# EAGLE design NQSMHS-V2_final (EAGLE 5.11)

## Sheet 1 of 4
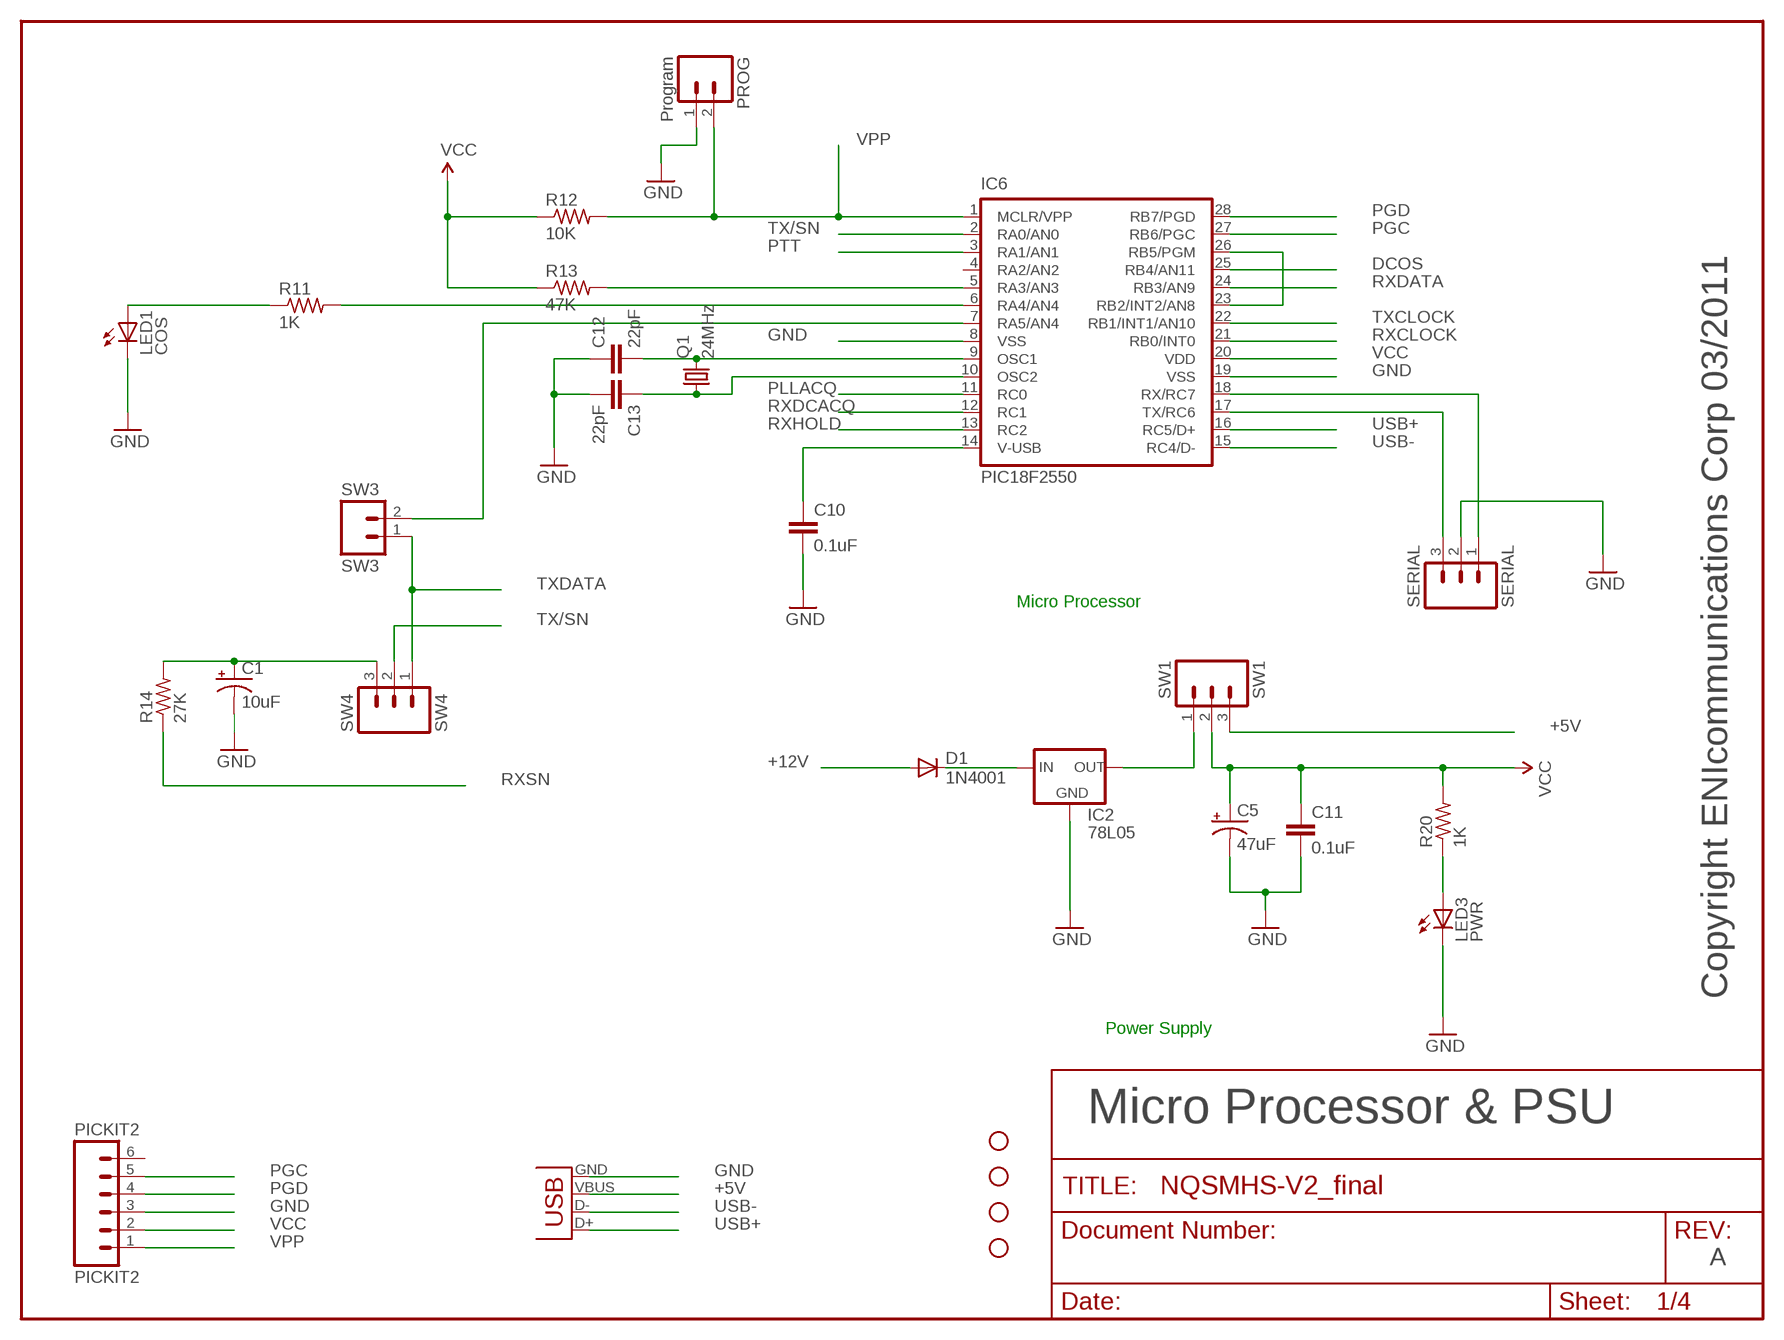
[diagram p0: schematic, sheet 1]

### Parts
C1  10uF  CAP_POLPTH2  [CPOL-RADIAL-10UF-25V]
C5  47uF  CAP_POLPTH2  [CPOL-RADIAL-10UF-25V]
C10  0.1uF  C2.5/2  [C2.5-2]
C11  0.1uF  C2.5/2  [C2.5-2]
C12  22pF  C2.5/2  [C2.5-2]
C13  22pF  C2.5/2  [C2.5-2]
D1  1N4001  DIODEPTH  [DIODE-1N4001]
IC2  78L05  78LXX  [78LXX]
IC6  PIC18F2550  [DIL28-3]
J1  USBPTH  [USB-B-PTH]
JP7  STAND-OFF  [STAND-OFF]
JP8  STAND-OFF  [STAND-OFF]
JP9  STAND-OFF  [STAND-OFF]
JP10  STAND-OFF  [STAND-OFF]
LED1  COS  LED5MM  [LED5MM]
LED3  PWR  LED5MM  [LED5MM]
PICKIT2  PICKIT2  M06SIP  [1X06]
PROG  Program  M02PTH  [1X02]
Q1  24MHz  CRYSTALHC49US  [HC49US]
R11  1K  R-US_0207/2V  [0207/2V]
R12  10K  R-US_0207/2V  [0207/2V]
R13  47K  R-US_0207/2V  [0207/2V]
R14  27K  R-US_0207/2V  [0207/2V]
R20  1K  R-US_0207/2V  [0207/2V]
SERIAL  SERIAL  M03PTH  [1X03]
SW1  SW1  M03PTH  [1X03]
SW3  SW3  M02PTH  [1X02]
SW4  SW4  M03PTH  [1X03]

### Nets
+5V: J1.VBUS SW1.3
+12V: D1.A ; also sheet 2
DCOS: IC6.25(RB4/AN11) ; also sheet 3
GND: C1.2(-) C5.2(-) C10.2 C11.2 C12.1 C13.2 IC2.GND IC6.8(VSS) IC6.19(VSS) J1.GND LED1.K(C) LED3.K(C) PICKIT2.3 PROG.1 SERIAL.2 ; also sheet 2,3,4
N$2: D1.C IC2.IN
N$3: IC6.23(RB2/INT2/AN8) IC6.26(RB5/PGM)
N$4: IC6.5(RA3/AN3) R13.2
N$5: IC6.6(RA4/AN4) R11.2
N$6: LED1.A R11.1
N$7: IC6.7(RA5/AN4) SW3.2
N$8: C1.1(+) R14.2 SW4.3
N$9: C12.2 IC6.9(OSC1) Q1.2
N$10: C13.1 IC6.10(OSC2) Q1.1
N$11: C10.1 IC6.14(V-USB)
N$12: IC2.OUT SW1.1
N$13: LED3.A R20.1
PGC: IC6.27(RB6/PGC) PICKIT2.5
PGD: IC6.28(RB7/PGD) PICKIT2.4
PLLACQ: IC6.11(RC0) ; also sheet 4
PTT: IC6.3(RA1/AN1) ; also sheet 2
RX-232: IC6.18(RX/RC7) SERIAL.1
RXCLOCK: IC6.21(RB0/INT0) ; also sheet 4
RXDATA: IC6.24(RB3/AN9) ; also sheet 4
RXDCACQ: IC6.12(RC1) ; also sheet 4
RXHOLD: IC6.13(RC2) ; also sheet 4
RXSN: R14.1 ; also sheet 3,4
TX-232: IC6.17(TX/RC6) SERIAL.3
TX/SN: IC6.2(RA0/AN0) SW4.2
TXCLOCK: IC6.22(RB1/INT1/AN10) ; also sheet 4
TXDATA: SW3.1 SW4.1 ; also sheet 4
USB+: IC6.16(RC5/D+) J1.D+
USB-: IC6.15(RC4/D-) J1.D-
VCC: C5.1(+) C11.1 IC6.20(VDD) PICKIT2.2 R12.1 R13.1 R20.2 SW1.2 ; also sheet 2,3,4
VPP: IC6.1(MCLR/VPP) PICKIT2.1 PROG.2 R12.2
Unconnected: IC6.4(RA2/AN2) PICKIT2.6

### Notes on the sheet
- Micro Processor
- Copyright ENIcommunications Corp 03/2011
- Power Supply
- Micro Processor & PSU
- A

## Sheet 2 of 4
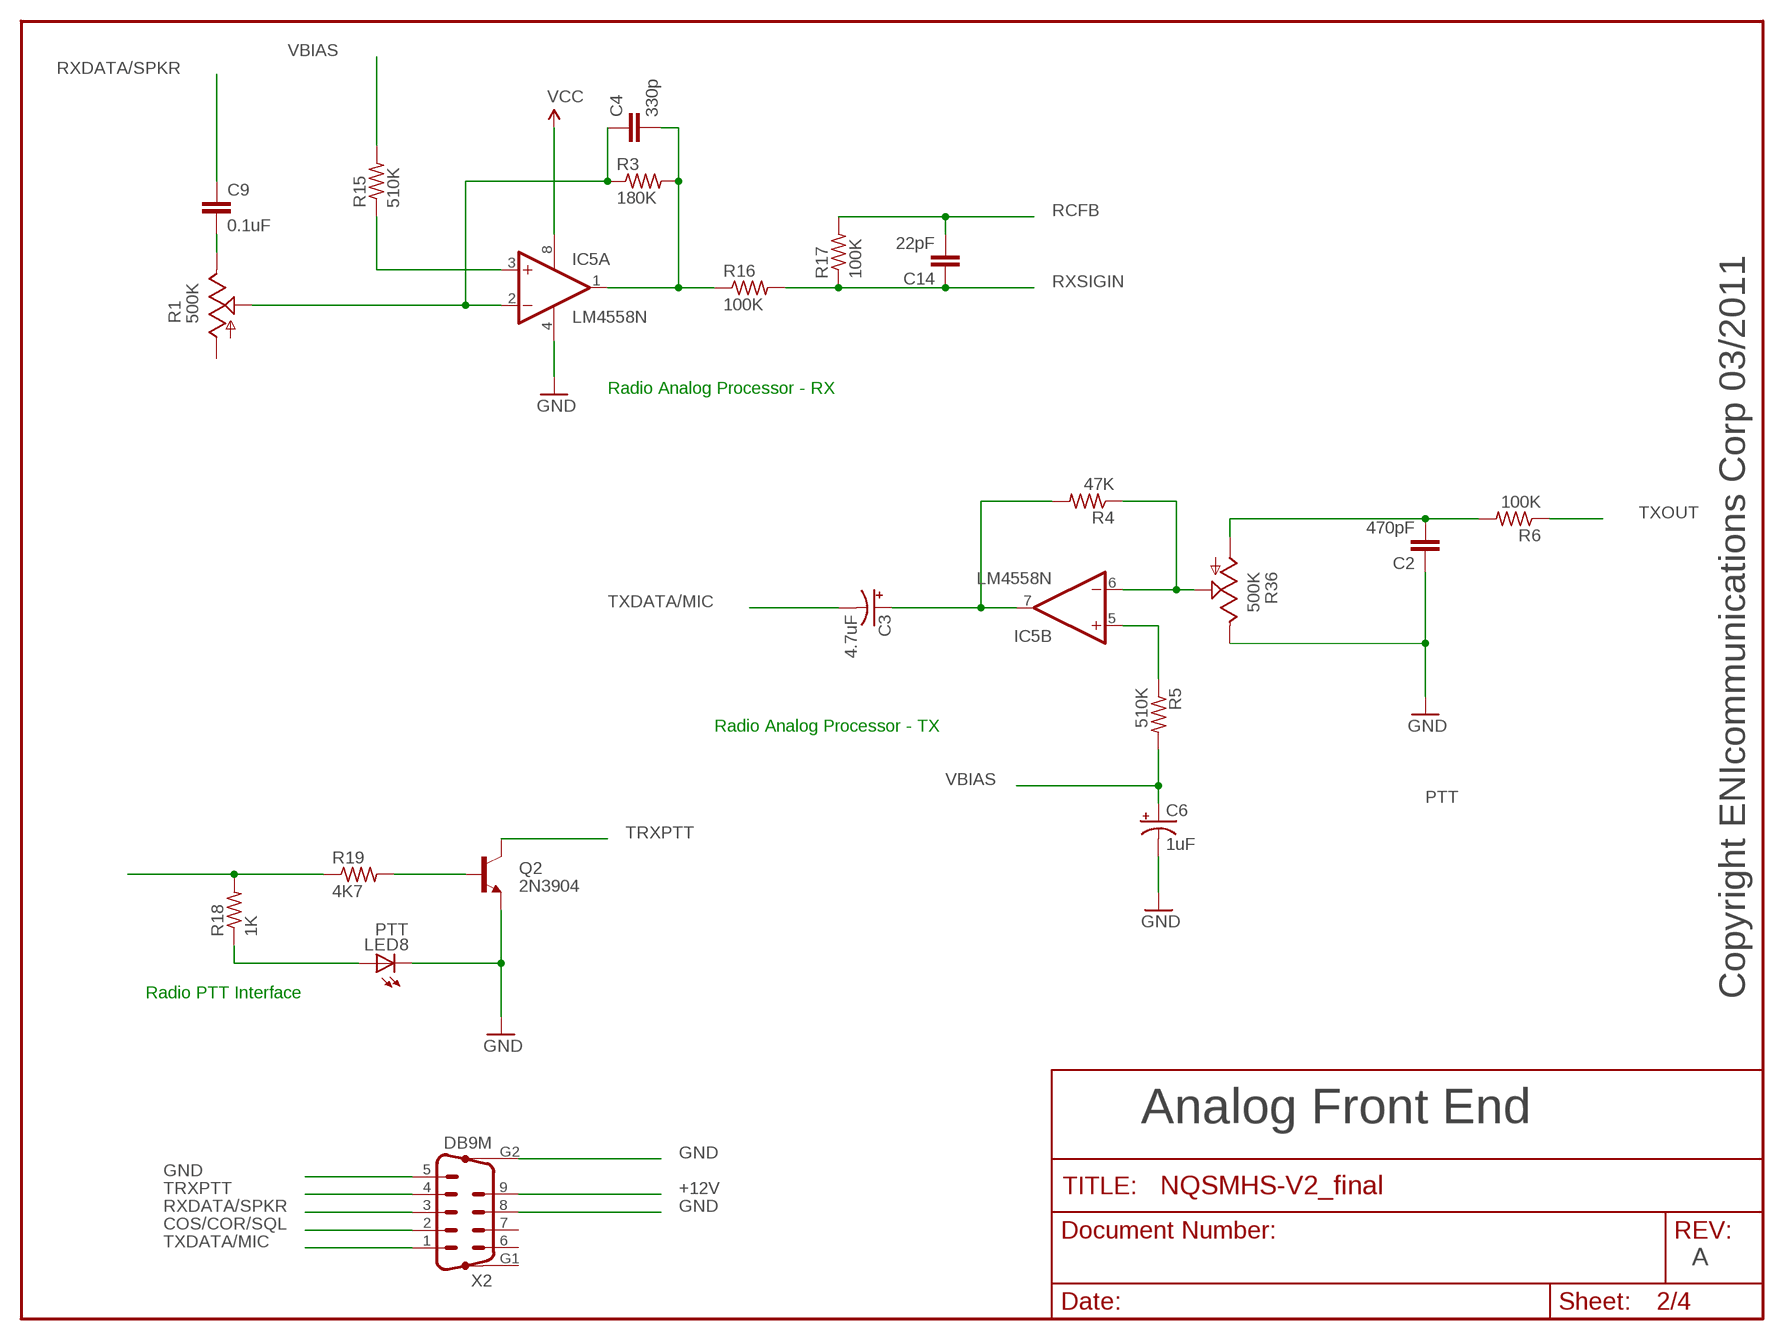
[diagram p1: schematic, sheet 2]

### Parts
C2  470pF  C2.5/2  [C2.5-2]
C3  4.7uF  CAP_POLPTH2  [CPOL-RADIAL-10UF-25V]
C4  330p  C2.5/2  [C2.5-2]
C6  1uF  CAP_POLPTH2  [CPOL-RADIAL-10UF-25V]
C9  0.1uF  C2.5/2  [C2.5-2]
C14  22pF  C2.5/2  [C2.5-2]
IC5  LM4558N  [DIL08]
LED8  PTT  LED5MM  [LED5MM]
Q2  2N3904  TRANSISTOR_NPNTO92  [TO-92]
R1  500K  TRIM_US-CA6V  [CA6V]
R3  180K  R-US_0207/2V  [0207/2V]
R4  47K  R-US_0207/2V  [0207/2V]
R5  510K  R-US_0207/2V  [0207/2V]
R6  100K  R-US_0207/2V  [0207/2V]
R15  510K  R-US_0207/2V  [0207/2V]
R16  100K  R-US_0207/2V  [0207/2V]
R17  100K  R-US_0207/2V  [0207/2V]
R18  1K  R-US_0207/2V  [0207/2V]
R19  4K7  R-US_0207/2V  [0207/2V]
R36  500K  TRIM_US-CA6V  [CA6V]
X2  DB9M  M09HP  [M09HP]

### Nets
+12V: X2.9 ; also sheet 1
COS/COR/SQL: X2.2
GND: C2.1 C6.2(-) IC5.4(P:V-) LED8.K(C) Q2.1(E) R36.E X2.5 X2.8 X2.G2 ; also sheet 1,3,4
N$15: Q2.2(B) R19.2
N$17: LED8.A R18.1
N$19: C3.1(+) IC5.7(B:OUT) R4.2
N$23: C4.2 IC5.1(A:OUT) R3.2 R16.1
N$25: IC5.5(B:+IN) R5.1
N$26: C4.1 IC5.2(A:-IN) R1.S R3.1
N$27: C2.2 R6.2 R36.A
N$28: IC5.6(B:-IN) R4.1 R36.S
N$37: C9.2 R1.E
N$40: IC5.3(A:+IN) R15.1
PTT: R18.2 R19.1 ; also sheet 1
RCFB: C14.2 R17.2 ; also sheet 4
RXDATA/SPKR: C9.1 X2.3
RXSIGIN: C14.1 R16.2 R17.1 ; also sheet 4
TRXPTT: Q2.3(C) X2.4
TXDATA/MIC: C3.2(-) X2.1
TXOUT: R6.1 ; also sheet 4
VBIAS: C6.1(+) R5.2 R15.2 ; also sheet 4
VCC: IC5.8(P:V+) ; also sheet 1,3,4
Unconnected: R1.A X2.6 X2.7 X2.G1

### Notes on the sheet
- Radio Analog Processor - RX
- Radio Analog Processor - TX
- Radio PTT Interface | Copyright ENIcommunications Corp 03/2011
- Analog Front End
- A

## Sheet 3 of 4
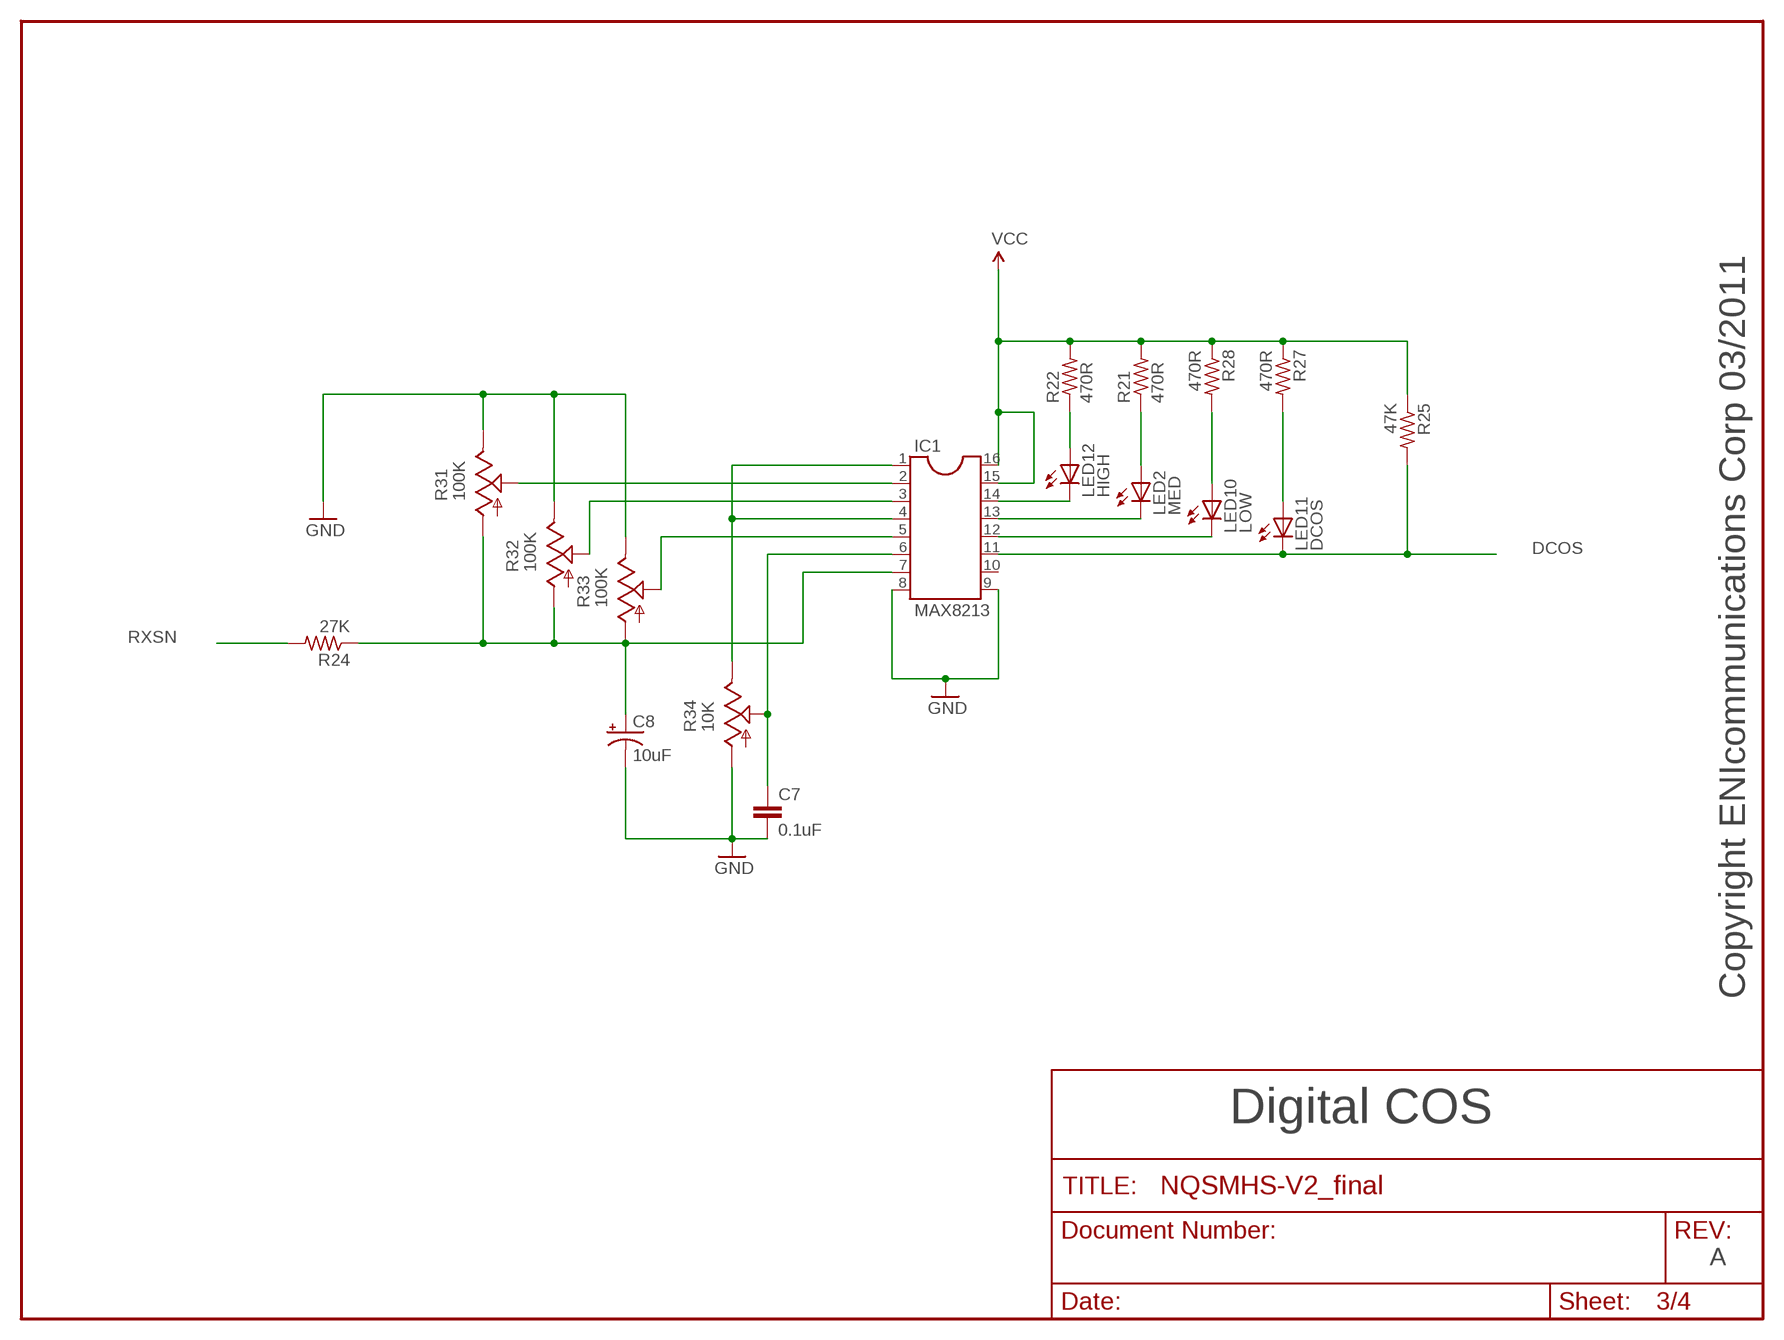
[diagram p2: schematic, sheet 3]

### Parts
C7  0.1uF  C2.5/2  [C2.5-2]
C8  10uF  CAP_POLPTH2  [CPOL-RADIAL-10UF-25V]
IC1  MAX8213  DIL16  [DIL16]
LED2  MED  LED5MM  [LED5MM]
LED10  LOW  LED5MM  [LED5MM]
LED11  DCOS  LED5MM  [LED5MM]
LED12  HIGH  LED5MM  [LED5MM]
R21  470R  R-US_0207/2V  [0207/2V]
R22  470R  R-US_0207/2V  [0207/2V]
R24  27K  R-US_0207/2V  [0207/2V]
R25  47K  R-US_0207/2V  [0207/2V]
R27  470R  R-US_0207/2V  [0207/2V]
R28  470R  R-US_0207/2V  [0207/2V]
R31  100K  TRIM_US-CA6V  [CA6V]
R32  100K  TRIM_US-CA6V  [CA6V]
R33  100K  TRIM_US-CA6V  [CA6V]
R34  10K  TRIM_US-CA6V  [CA6V]

### Nets
DCOS: IC1.11 LED11.K(C) R25.2 ; also sheet 1
GND: C7.2 C8.2(-) IC1.8 IC1.9 R31.E R32.E R33.E R34.A ; also sheet 1,2,4
N$14: C7.1 IC1.6 R34.S
N$16: IC1.14 LED12.K(C)
N$41: LED12.A R22.1
N$44: IC1.13 LED2.K(C)
N$45: LED2.A R21.1
N$46: IC1.12 LED10.K(C)
N$47: LED11.A R27.2
N$48: LED10.A R28.2
N$49: IC1.2 R31.S
N$50: IC1.3 R32.S
N$51: IC1.5 R33.S
N$52: IC1.1 IC1.4 R34.E
N$53: C8.1(+) IC1.7 R24.1 R31.A R32.A R33.A
RXSN: R24.2 ; also sheet 1,4
VCC: IC1.15 IC1.16 R21.2 R22.2 R25.1 R27.1 R28.1 ; also sheet 1,2,4
Unconnected: IC1.10

### Notes on the sheet
- Copyright ENIcommunications Corp 03/2011
- Digital COS
- A

## Sheet 4 of 4
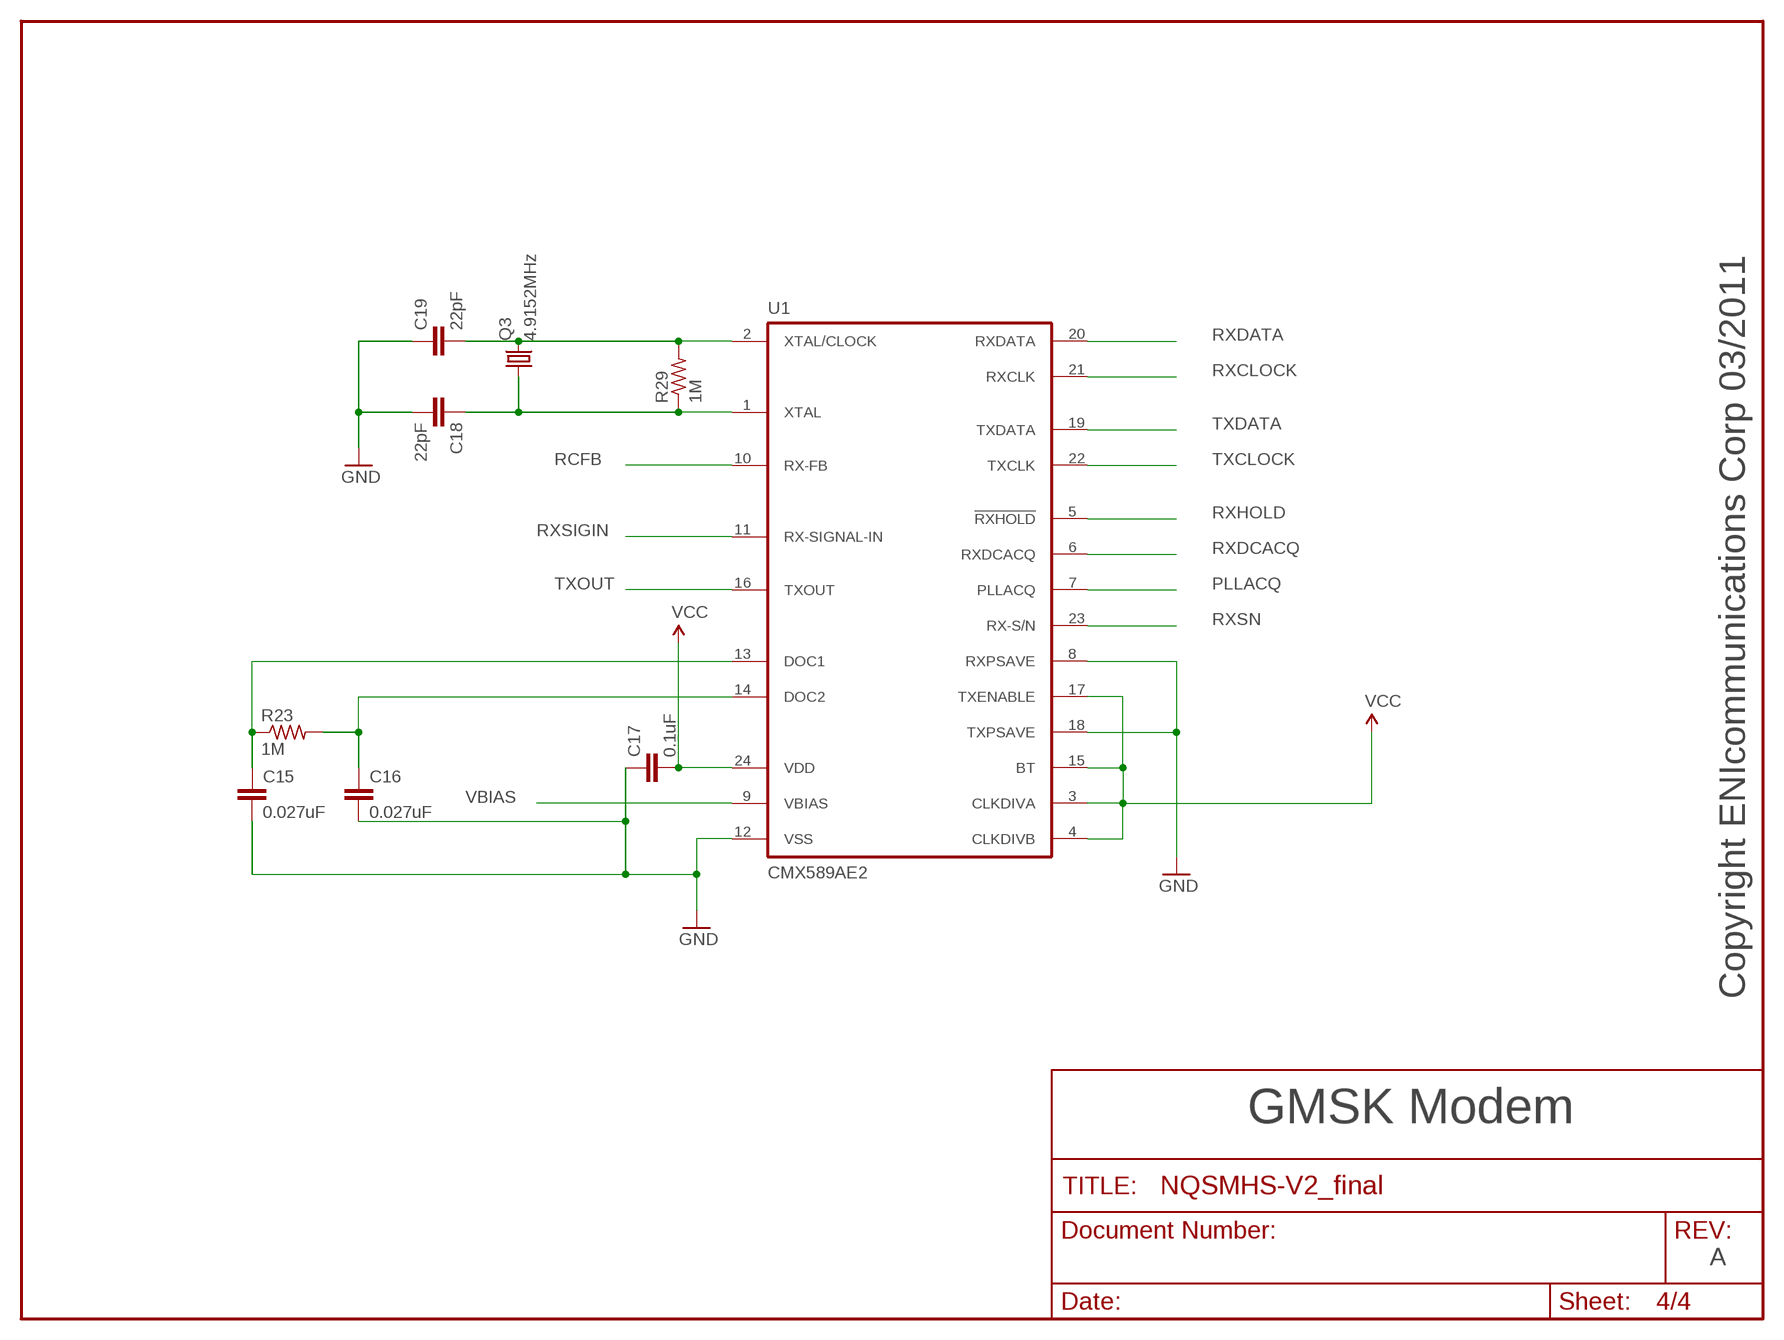
[diagram p3: schematic, sheet 4]

### Parts
C15  0.027uF  C2.5/2  [C2.5-2]
C16  0.027uF  C2.5/2  [C2.5-2]
C17  0.1uF  C2.5/2  [C2.5-2]
C18  22pF  C2.5/2  [C2.5-2]
C19  22pF  C2.5/2  [C2.5-2]
Q3  4.9152MHz  CRYSTALHC49US  [HC49US]
R23  1M  R-US_0207/2V  [0207/2V]
R29  1M  R-US_0207/2V  [0207/2V]
U1  CMX589AE2  [TSSOP24]

### Nets
GND: C15.2 C16.2 C17.1 C18.2 C19.1 U1.8(RXPSAVE) U1.12(VSS) U1.18(TXPSAVE) ; also sheet 1,2,3
N$1: C15.1 R23.1 U1.13(DOC1)
N$21: C16.1 R23.2 U1.14(DOC2)
N$22: C18.1 Q3.1 R29.1 U1.1(XTAL)
N$24: C19.2 Q3.2 R29.2 U1.2(XTAL/CLOCK)
PLLACQ: U1.7(PLLACQ) ; also sheet 1
RCFB: U1.10(RX-FB) ; also sheet 2
RXCLOCK: U1.21(RXCLK) ; also sheet 1
RXDATA: U1.20(RXDATA) ; also sheet 1
RXDCACQ: U1.6(RXDCACQ) ; also sheet 1
RXHOLD: U1.5(!RXHOLD!) ; also sheet 1
RXSIGIN: U1.11(RX-SIGNAL-IN) ; also sheet 2
RXSN: U1.23(RX-S/N) ; also sheet 1,3
TXCLOCK: U1.22(TXCLK) ; also sheet 1
TXDATA: U1.19(TXDATA) ; also sheet 1
TXOUT: U1.16(TXOUT) ; also sheet 2
VBIAS: U1.9(VBIAS) ; also sheet 2
VCC: C17.2 U1.3(CLKDIVA) U1.4(CLKDIVB) U1.15(BT) U1.17(TXENABLE) U1.24(VDD) ; also sheet 1,2,3

### Notes on the sheet
- Copyright ENIcommunications Corp 03/2011
- GMSK Modem
- A

## Library data of the parts
C1 C3 C5 C6 C8 = SparkFun:CAP_POL: Capacitor Polarized These are standard SMD and PTH capacitors. Normally 10uF, 47uF, and 100uF in electrolytic and tantalum varieties. Always verify the external diameter of the through hole cap, it varies with capacity, voltage, and manufacturer. The EIA devices should be standard.
C2 C4 C7 C9-C19 = capacitor-wima:C: CAPACITOR naming: grid - package width
D1 = SparkFun:DIODE: Diode These are standard reverse protection diodes and small signal diodes. SMA package can handle up to about 1A. SOD-323 can handle about 200mA. What the SOD-323 package when ordering, there are some mfgs out there that are 5-pin packages.
IC1 = ic-package:DIL16: Dual In Line / Socket
IC2 = v-reg:78LXX: VOLTAGE REGULATOR
IC5 = linear:*4558: OP AMP
IC6 = SparkFun:PIC18F2550
J1 = SparkFun:USB: USB Connectors USB-B-PTH is fully proven SKU : PRT-00139 USB-miniB is fully proven SKU : PRT-00587 USB-A-PCB is untested. USB-A-H is throughly reviewed, but untested. Spark Fun Electronics SKU : PRT-00437 USB-B-SMT is throughly reviewed, but untested. Needs silkscreen touching up. USB-A-S has not been used/tested USB-MB-H has not been used/tested
JP7-JP10 = SparkFun:STAND-OFF: Stand Off This is the mechanical footprint for a #4 phillips button head screw. Use the keepout ring to avoid running the screw head into surrounding components. SKU : PRT-00447
LED1-LED3 LED8 LED10-LED12 = SparkFun:LED: LEDs Standard schematic elements and footprints for 5mm, 3mm, 1206, and 0603 sized LEDs. 5mm - Spark Fun Electronics SKU : COM-00529 (and others)
PICKIT2 = SparkFun:M06: Header 6 Standard 6-pin 0.1" header. Use with straight break away headers (SKU : PRT-00116), right angle break away headers (PRT-00553), swiss pins (PRT-00743), machine pins (PRT-00117), and female headers (PRT-00115). Molex polarized connector foot print use with SKU : PRT-08094 with associated crimp pins and housings. NOTES ON THE VARIANTS LOCK and LOCK_LONGPADS... This footprint was designed to help hold the alignment of a through-hole component (i.e. 6-pin header) while soldering it into place. You may notice that each hole has been shifted either up or down by 0.005 of an inch from it's more standard position (which is a perfectly straight line). This slight alteration caused the pins (the squares in the middle) to touch the edges of the holes. Because they are alternating, it causes a "brace" to hold the component in place. 0.005 has proven to be the perfect amount of "off-center" position when using our standard breakaway headers. Although looks a little odd when you look at the bare footprint, once you have a header in there, the alteration is very hard to notice. Also, if you push a header all the way into place, it is covered up entirely on the bottom side. This idea of altering the position of holes to aid alignment will be further integrated into the Sparkfun Library for other footprints. It can help hold any component with 3 or more connection pins.
PROG SW3 = SparkFun:M02: Header 2 Standard 2-pin 0.1" header. Use with straight break away headers (SKU : PRT-00116), right angle break away headers (PRT-00553), swiss pins (PRT-00743), machine pins (PRT-00117), and female headers (PRT-00115). Molex polarized connector foot print use with SKU : PRT-08233 with associated crimp pins and housings.
Q1 Q3 = SparkFun:CRYSTAL: Crystals Various standard crystals. Proven footprints. Spark Fun Electronics SKU : COM-00534
Q2 = SparkFun:TRANSISTOR_NPN: Transistor NPN BJT configuration in SOT23 package. MMBT2222 is the common NPN we use. Double check BCE configuration again layout.
R1 R31-R34 R36 = pot:TRIM_US-: POTENTIOMETER
R3-R6 R11-R25 R27-R29 = resistor:R-US_: RESISTOR, American symbol
SERIAL SW1 SW4 = SparkFun:M03: Header 3 Standard 3-pin 0.1" header. Use with straight break away headers (SKU : PRT-00116), right angle break away headers (PRT-00553), swiss pins (PRT-00743), machine pins (PRT-00117), and female headers (PRT-00115). Molex polarized connector foot print use with SKU : PRT-08232 with associated crimp pins and housings.
U1 = cml-micro:CMX589A: HIGH-SPEED GMSK MODEM
X2 = con-subd:M09HP: SUB-D

## Board
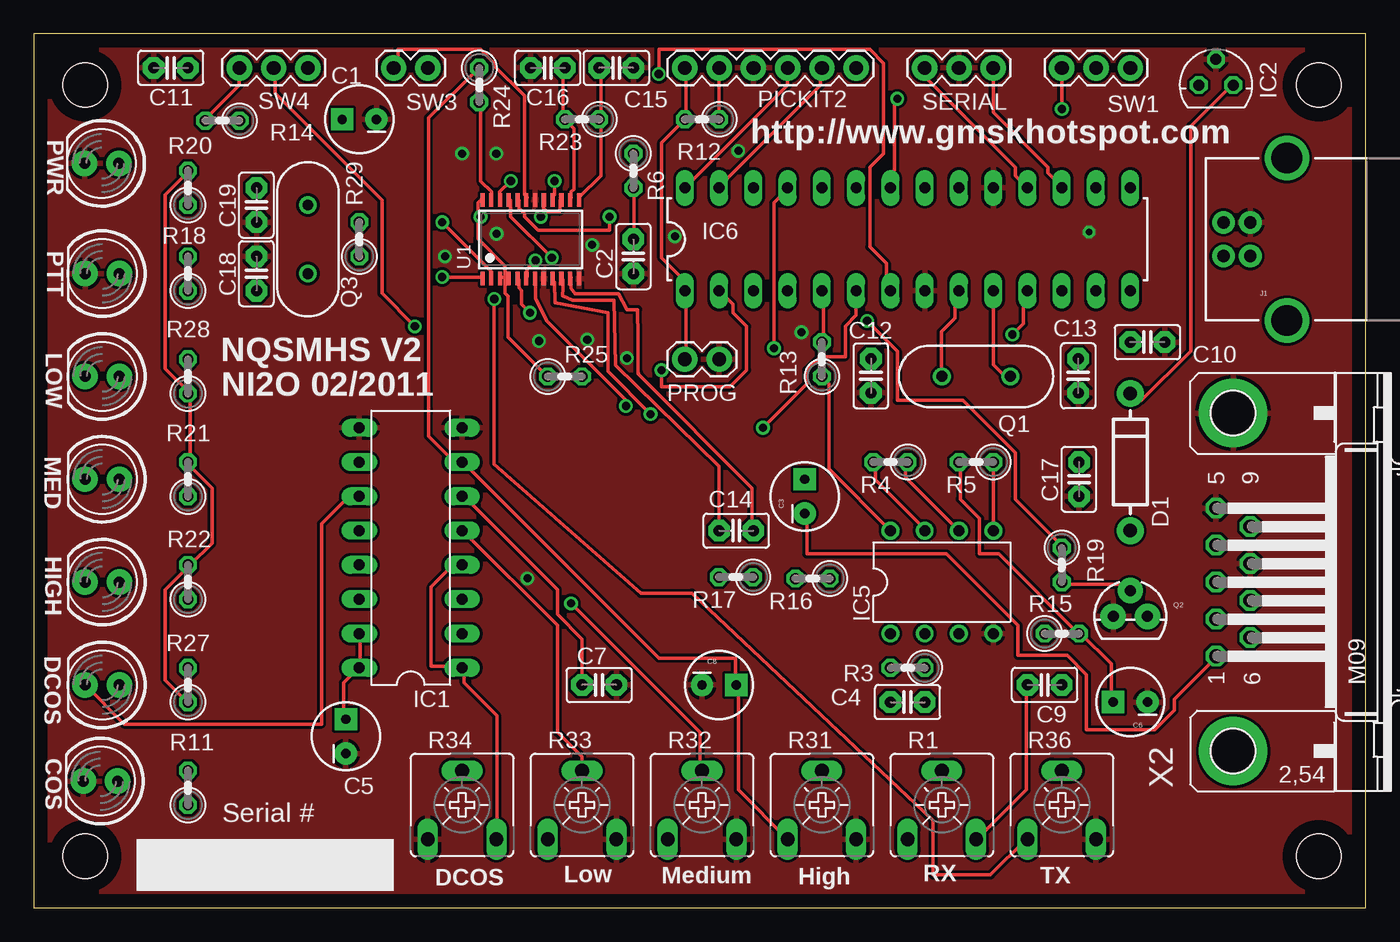
[diagram p4: board, top side]
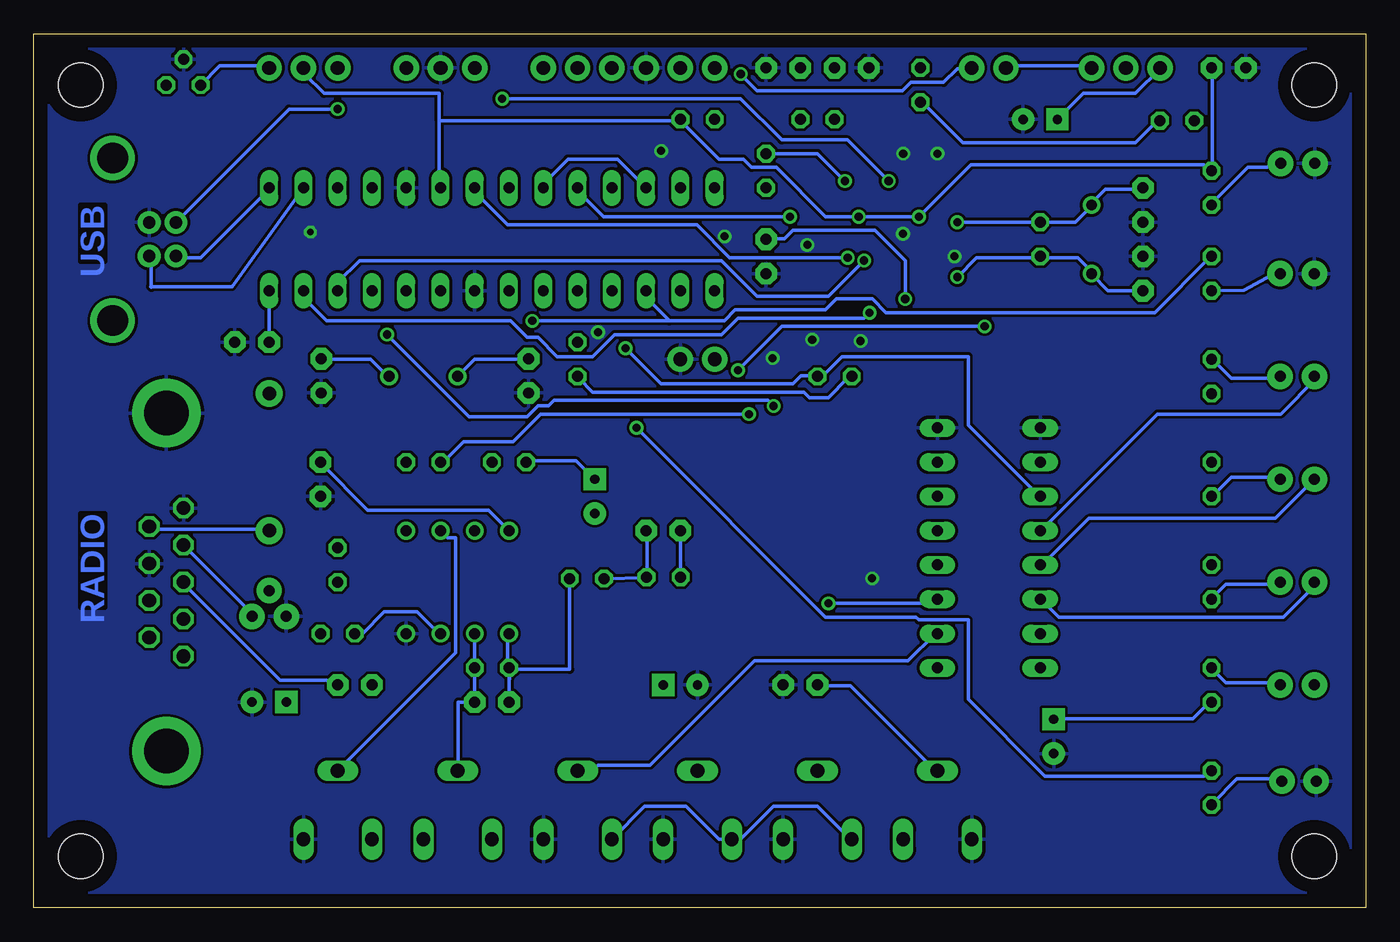
[diagram p5: board, bottom side, seen from below]

Size 98.73 x 64.76 mm. Coordinates in mm from the lower left corner, seen from the top.
Outline: 98.73,0 98.73,64.76 0,64.76 0,0 98.73,0
Copper layers (1*16): Top 0.035mm / dielectric 1.5mm / Bottom 0.035mm
Design rules "default": minimum track width 10mil, minimum drill 24mil, track to track 8mil, track to pad 8mil, pad to pad 8mil, via to via 8mil, smd to smd 8mil, copper to edge 40mil, drill to drill 8mil, minimum pad ring 10mil, minimum via ring 8mil, stop-mask expansion 4mil, vias tented up to drill 0mil, thermal gap 10mil

### Footprints (pad centres in the part's own frame; a part is rotated, then mirrored left to right if it is on the bottom)
CPOL-RADIAL-10UF-25V = drill 0.7 pad 1.651 square: 1 1.27,0 | drill 0.7 pad 1.651 round: 2 -1.27,0
C2.5-2 = drill 0.813 pad 1.6 octagon: 1 -1.27,0; 2 1.27,0
DIODE-1N4001 = drill 1 pad 1.981 round: A -5.08,0; C 5.08,0
DIL16 = drill 0.813 long: 1 -8.89,-3.81; 2 -6.35,-3.81; 3 -3.81,-3.81; 4 -1.27,-3.81; 5 1.27,-3.81; 6 3.81,-3.81; 7 6.35,-3.81; 8 8.89,-3.81; 9 8.89,3.81; 10 6.35,3.81; 11 3.81,3.81; 12 1.27,3.81; 13 -1.27,3.81; 14 -3.81,3.81; 15 -6.35,3.81; 16 -8.89,3.81
78LXX = drill 0.813 octagon: GND 0,1.905; IN 1.27,0; OUT -1.27,0
DIL08 = drill 0.813 pad 1.27 round: 1 -3.81,-3.81; 2 -1.27,-3.81; 3 1.27,-3.81; 4 3.81,-3.81; 5 3.81,3.81; 6 1.27,3.81; 7 -1.27,3.81; 8 -3.81,3.81
DIL28-3 = drill 0.813 long: 1 -16.51,-3.81; 2 -13.97,-3.81; 3 -11.43,-3.81; 4 -8.89,-3.81; 5 -6.35,-3.81; 6 -3.81,-3.81; 7 -1.27,-3.81; 8 1.27,-3.81; 9 3.81,-3.81; 10 6.35,-3.81; 11 8.89,-3.81; 12 11.43,-3.81; 13 13.97,-3.81; 14 16.51,-3.81; 15 16.51,3.81; 16 13.97,3.81; 17 11.43,3.81; 18 8.89,3.81; 19 6.35,3.81; 20 3.81,3.81; 21 1.27,3.81; 22 -1.27,3.81; 23 -3.81,3.81; 24 -6.35,3.81; 25 -8.89,3.81; 26 -11.43,3.81; 27 -13.97,3.81; 28 -16.51,3.81
USB-B-PTH = drill 0.914 pad 1.676 round: D+ 0,1.25; D- 1.981,1.25; GND 0,-1.25; VBUS 1.981,-1.25 | drill 2.286 round: P$1 -2.718,-6.02; P$2 -2.718,6.02
STAND-OFF = hole 3.302: 0,0
LED5MM = drill 0.813 pad 1.88 round: A -1.27,0; K 1.27,0
1X06 = drill 1.016 pad 1.88 round: 1 0,0; 2 2.54,0; 3 5.08,0; 4 7.62,0; 5 10.16,0; 6 12.7,0
1X02 = drill 1.016 pad 1.88 round: 1 0,0; 2 2.54,0
HC49US = drill 0.813 round: 1 -2.54,0; 2 2.54,0
TO-92 = drill 0.813 pad 1.88 round: 1 -1.27,0; 2 0,1.905; 3 1.27,0
CA6V = drill 1.016 long: A -2.54,-2.54; E 2.54,-2.54; S 0,2.54
0207/2V = drill 0.813 octagon: 1 -1.27,0; 2 1.27,0
1X03 = drill 1.016 pad 1.88 round: 1 0,0; 2 2.54,0; 3 5.08,0
TSSOP24 = smd 0.305 x 0.991: 1 -3.575,-2.918; 2 -2.925,-2.918; 3 -2.275,-2.918; 4 -1.625,-2.918; 5 -0.975,-2.918; 6 -0.325,-2.918; 7 0.325,-2.918; 8 0.975,-2.918; 9 1.625,-2.918; 10 2.275,-2.918; 11 2.925,-2.918; 12 3.575,-2.918; 13 3.575,2.918; 14 2.925,2.918; 15 2.275,2.918; 16 1.625,2.918; 17 0.975,2.918; 18 0.325,2.918; 19 -0.325,2.918; 20 -0.975,2.918; 21 -1.625,2.918; 22 -2.275,2.918; 23 -2.925,2.918; 24 -3.575,2.918
M09HP = drill 1.016 octagon: 1 -5.486,1.27; 2 -2.743,1.27; 3 0,1.27; 4 2.743,1.27; 5 5.486,1.27; 6 -4.115,-1.27; 7 -1.372,-1.27; 8 1.372,-1.27; 9 4.115,-1.27 | drill 3.302 pad 5.08 round: G1 -12.522,0; G2 12.522,0

### Placement (x,y rotation side)
C1  24.13,58.42 180 top
C2  44.45,48.26 90 top
C3  57.15,30.48 90 top
C4  64.77,15.24 180 top
C5  23.13,12.7 90 top
C6  81.28,15.24 180 top
C7  41.91,16.51 0 top
C8  50.8,16.51 0 top
C9  74.93,16.51 180 top
C10  82.55,41.91 0 top
C11  10.16,62.23 180 top
C12  62.05,39.41 90 top
C13  77.42,39.41 270 top
C14  52.07,27.94 180 top
C15  43.18,62.23 0 top
C16  38.1,62.23 180 top
C17  77.47,31.75 90 top
C18  16.51,46.99 90 top
C19  16.51,52.07 90 top
D1  81.28,33.02 90 top
IC1  27.94,26.67 90 top
IC2  87.63,60.96 0 top
IC5  67.31,24.13 0 top
IC6  64.77,49.53 0 top
J1  90.17,49.53 180 top
JP7  3.81,3.81 0 top
JP8  95.25,3.81 0 top
JP9  3.81,60.96 0 top
JP10  95.25,60.96 0 top
LED1  4.94,9.39 180 top
LED2  5.08,31.75 180 top
LED3  5.03,55.16 180 top
LED8  5.08,46.99 180 top
LED10  5.08,39.37 180 top
LED11  5.08,16.51 180 top
LED12  5.08,24.13 180 top
PICKIT2  48.26,62.23 0 top
PROG  50.8,40.64 180 top
Q1  69.85,39.37 180 top
Q2  81.28,21.59 0 top
Q3  20.32,49.53 90 top
R1  67.31,7.62 0 top
R3  64.77,17.78 180 top
R4  63.5,33.02 180 top
R5  69.85,33.02 180 top
R6  44.45,54.61 270 top
R11  11.43,8.89 90 top
R12  49.53,58.42 180 top
R13  58.42,40.64 90 top
R14  13.99,58.32 180 top
R15  76.2,20.32 0 top
R16  57.73,24.39 180 top
R17  52.04,24.5 180 top
R18  11.43,46.99 90 top
R19  76.2,25.4 270 top
R20  11.43,53.34 90 top
R21  11.43,31.75 90 top
R22  11.43,24.13 90 top
R23  40.64,58.42 180 top
R24  33.02,60.96 270 top
R25  39.37,39.37 0 top
R27  11.43,16.51 90 top
R28  11.43,39.37 90 top
R29  24.13,49.53 90 top
R31  58.42,7.62 0 top
R32  49.53,7.62 0 top
R33  40.64,7.62 0 top
R34  31.75,7.62 0 top
R36  76.2,7.62 0 top
SERIAL  66.04,62.23 0 top
SW1  81.28,62.23 180 top
SW3  26.67,62.23 0 top
SW4  20.32,62.23 180 top
U1  36.83,49.53 0 top
X2  88.9,24.13 90 top

### Tracks (layer width: path | path; a pad name or v marks a point on that pad's centre or on a via)
+5V  (via drill 0.61)
  Top 0.254: v76.2,59.18 SW1.3
  Bottom 0.254: v76.2,59.18 79.81,59.18 88.19,50.8 J1.VBUS
+12V
  Bottom 0.254: X2.9 90.02,28.25 89.81,28.04 81.28,28.04 D1.A
DCOS  (via drill 0.61)
  Top 0.254: v54.86,41.45 54.86,52.22 55.88,53.24 IC6.25 | LED11.K 6.71,13.61 21.34,13.61 21.34,28.45 23.37,30.48 IC1.11
  Bottom 0.254: 40.64,39.42 40.23,39.42 38.81,40.84 29.46,40.84 29.46,35.76 24.18,30.48 IC1.11 | v54.86,41.45 52.22,38.81 42.47,38.81 41.86,39.42 40.64,39.42 | 40.64,39.42 R25.2
GND  (via drill 0.5, 0.6)
  other vias: 31.75,55.88 34.29,55.88 30.48,48.26 43.97,40.72 41.03,42.1 34.3,49.94 36.6,24.41 52.22,56.09 37.45,41.99 41.4,49.12 47.52,49.74 56.9,42.65 78.22,50.07
  pour Bottom: 0,64.77 99.06,64.77 99.06,0 0,0
  pour Top: 0,-0.23 98.65,-0.23 98.65,64.85 0,64.85
N$1
  Top 0.254: U1.13 40.44,52.63 42.06,54.25 42.06,58.32 R23.1 42.06,58.52 42.06,62.18 C15.1
N$2
  Top 0.254: IC2.IN 88.8,60.96 85.75,57.91 85.75,41.25 82.09,37.59 81.28,37.59 D1.C
N$3
  Bottom 0.254: IC6.26 55.47,55.47 59.13,55.47 60.96,53.65 IC6.23
N$4
  Top 0.254: R13.2 58.52,42.06 58.52,45.72 IC6.5
N$5  (via drill 0.61)
  Top 0.254: v54.05,35.56 57.3,38.81 57.3,39.83 58.32,40.84 60.15,40.84 60.15,43.08 60.96,43.89 IC6.6
  Bottom 0.254: v54.05,35.56 40.03,21.54 33.33,21.54 33.12,21.34 29.46,21.34 29.46,15.44 23.77,9.75 11.99,9.75 11.58,10.16 R11.2
N$6
  Bottom 0.254: R11.1 11.38,7.72 9.55,9.55 6.3,9.55 LED1.A
N$7  (via drill 0.61)
  Top 0.254: v46.33,61.77 46.33,63.6 61.98,63.6 62.99,62.59 62.99,55.88 61.98,54.86 61.98,48.97 63.2,47.75 63.2,45.92 63.4,45.72 IC6.7
  Bottom 0.254: v46.33,61.77 45.11,60.55 34.34,60.55 33.73,61.16 31.29,61.16 30.28,62.18 29.26,62.18 SW3.2
N$8
  Top 0.254: R14.2 12.8,58.52 15.24,60.96 SW4.3
  Bottom 0.254: C1.1 20.93,60.35 17.07,60.35 15.24,62.18 SW4.3
N$9
  Top 0.254: IC6.9 68.48,45.72 68.28,45.52 68.28,43.69 67.26,42.67 67.26,39.42 Q1.2
  Bottom 0.254: Q1.2 66.04,40.64 62.18,40.64 C12.2
N$10
  Top 0.254: IC6.10 71.12,40.23 71.93,39.42 72.34,39.42 Q1.1
  Bottom 0.254: Q1.1 72.54,39.42 73.76,40.64 77.22,40.64 C13.1
N$11
  Bottom 0.254: C10.1 IC6.14
N$12
  Bottom 0.254: IC2.OUT 84.94,62.38 81.28,62.38 SW1.1
N$13
  Bottom 0.254: R20.1 11.38,52.22 8.74,54.86 7.32,54.86 7.11,55.07 6.5,55.07 LED3.A
N$14
  Top 0.254: IC1.6 31.9,30.48 38.81,23.57 38.81,21.74 40.64,19.91 C7.1
  Bottom 0.254: R34.S 31.9,10.16 38.2,16.46 40.64,16.46 C7.1
N$15
  Top 0.254: R19.2 76.2,23.98 81.28,23.98 Q2.2
N$16
  Bottom 0.254: IC1.14 23.98,22.76 22.76,21.54 6.1,21.54 3.66,23.98 LED12.K
N$17
  Bottom 0.254: R18.1 11.38,45.72 9.03,45.76 6.5,47.14 LED8.A
N$19
  Top 0.254: IC5.7 66.04,28.04 62.38,31.7 62.38,32.92 R4.2
  Bottom 0.254: C3.1 58.52,33.12 62.18,33.12 R4.2
N$21
  Top 0.254: U1.14 39.83,52.63 39.83,53.03 40.03,53.24 40.03,57.71 39.42,58.32 R23.2 39.22,58.52 39.22,62.18 C16.1
N$22  (via drill 0.61)
  Top 0.254: v30.28,46.74 33.12,46.74 U1.1
  Bottom 0.254: C18.1 19.1,45.72 20.32,46.94 Q3.1 20.32,47.14 21.34,48.16 23.98,48.16 R29.1 24.18,48.16 28.85,48.16 v30.28,46.74
N$23
  Bottom 0.254: 63.48,16.04 63.48,17.66 59,17.67 R16.1 | 63.48,16.04 C4.2 | 63.48,16.04 R3.2 63.6,17.88 63.6,20.32 IC5.1
N$24  (via drill 0.61)
  Top 0.254: v30.28,50.8 33.93,47.14 33.93,46.74 U1.2
  Bottom 0.254: C19.2 16.66,53.24 19.3,53.24 20.32,52.22 Q3.2 20.32,52.02 21.54,50.8 R29.2 v30.28,50.8
N$25
  Top 0.254: IC5.5 R5.1
N$26
  Bottom 0.254: IC5.2 R3.1 C4.1 67.26,15.24 67.26,10.16 R1.S
N$27  (via drill 0.61)
  Top 0.254: R6.2 44.5,53.24 44.5,49.58 C2.2 | v34.14,45.11 34.14,32.87 45.01,23.3 48.78,23.32 66.65,6.5 66.65,2.44 70.92,2.44 73.56,5.08 R36.A
  Bottom 0.254: v34.14,45.11 34.14,47.95 36.37,50.19 42.47,50.19 43.08,49.58 44.3,49.58 C2.2
N$28
  Top 0.254: IC5.6 64.62,31.9 64.62,32.92 R4.1
  Bottom 0.254: R36.S 67.46,18.9 67.46,27.43 68.07,27.43 IC5.6
N$37
  Top 0.254: R1.E 69.9,5.08 73.56,8.74 73.56,16.46 C9.2
N$40
  Bottom 0.254: IC5.3 68.68,20.32 70.31,21.95 72.75,21.95 74.37,20.32 R15.1
N$41
  Bottom 0.254: R22.1 11.38,22.96 10.36,23.98 6.5,23.98 LED12.A
N$44
  Bottom 0.254: IC1.13 23.98,25.4 20.52,28.85 6.71,28.85 LED2.K
N$45
  Bottom 0.254: R21.1 11.38,30.48 9.96,31.9 6.5,31.9 LED2.A
N$46
  Bottom 0.254: IC1.12 23.98,28.04 15.44,36.58 6.3,36.58 3.66,39.22 LED10.K
N$47
  Bottom 0.254: R27.2 11.38,17.68 10.36,16.66 6.5,16.66 LED11.A
N$48
  Bottom 0.254: R28.2 11.38,40.64 9.96,39.22 6.5,39.22 LED10.A
N$49
  Bottom 0.254: IC1.2 31.9,20.32 33.93,18.29 45.31,18.29 53.03,10.57 56.9,10.57 57.3,10.16 R31.S
N$50  (via drill 0.61)
  Top 0.254: v39.83,22.55 49.38,13.01 49.38,10.16 R32.S
  Bottom 0.254: v39.83,22.55 32.11,22.55 31.9,22.76 IC1.3
N$51
  Top 0.254: R33.S 40.64,11.18 38.81,13.01 38.81,20.93 31.9,27.84 IC1.5
N$52
  Top 0.254: IC1.4 31.09,25.4 29.46,23.77 29.46,17.88 31.7,17.88 IC1.1 31.9,17.68 31.9,16.66 34.34,14.22 34.34,5.08 R34.E
N$53
  Top 0.254: R24.1 32.92,62.18 29.26,58.52 29.26,34.95 31.09,33.12 31.7,33.12 IC1.7 31.9,32.92 46.33,18.49 52.02,18.49 52.02,16.66 C8.1 52.22,16.46 52.22,8.74 R31.A
  Bottom 0.254: R33.A 38.2,5.08 40.64,7.52 43.89,7.52 46.33,5.08 R32.A 47.95,5.08 50.39,7.52 53.44,7.52 R31.A
PGC
  Top 0.254: IC6.27 50.8,53.44 58.32,60.96 58.32,62.18 PICKIT2.5
PGD
  Top 0.254: IC6.28 55.88,60.96 PICKIT2.4
PLLACQ  (via drill 0.61)
  Top 0.254: v43.89,37.19 43.89,37.59 38,43.48 37.22,45.09 37.19,45.11 37.19,46.53 U1.7 | v72.54,42.47 73.36,43.28 73.36,45.52 73.56,45.72 IC6.11
  Bottom 0.254: v43.89,37.19 44.3,37.59 60.15,37.59 60.55,37.19 61.37,37.19 62.18,36.37 66.45,36.37 v72.54,42.47
PTT  (via drill 0.61)
  Top 0.254: v61.77,43.48 64.01,41.25 64.01,37.59 68.89,37.59 72.75,33.73 72.75,30.28 76.2,26.82 R19.1
  Bottom 0.254: 51.61,43.48 47.55,43.48 46.74,44.3 40.03,44.3 39.22,45.11 36.58,45.11 35.56,44.09 15.65,44.09 11.58,48.16 R18.2 | 51.61,43.48 53.24,45.11 53.24,45.72 IC6.3 | 51.61,43.48 v61.77,43.48
RCFB
  Top 0.254: U1.10 39.22,46.53 39.22,45.92 39.21,45.35 39.93,45.02 43.03,45.02 43.12,40.2 50.8,32.72 C14.2
  Bottom 0.254: R17.2 50.78,25.55 50.8,26.62 C14.2
RX-232
  Top 0.254: IC6.18 72.75,54.25 72.75,54.86 66.04,61.57 SERIAL.1
RXCLOCK  (via drill 0.61)
  Top 0.254: v38.41,48.16 35.36,51.21 35.36,52.43 U1.21
  Bottom 0.254: v38.41,48.16 47.14,48.16 49.58,50.6 63.6,50.6 66.04,53.03 IC6.21
RXDATA  (via drill 0.61)
  Top 0.254: v42.67,51.21 42.67,50.19 37.39,50.19 36.37,51.21 36.37,51.41 35.97,51.82 35.97,52.43 U1.20
  Bottom 0.254: v42.67,51.21 56.49,51.21 58.52,53.24 IC6.24
RXDATA/SPKR
  Bottom 0.254: X2.3 87.58,23.98 80.47,16.87 77.01,16.87 76.81,16.66 76.2,16.66 C9.1
RXDCACQ  (via drill 0.61)
  Top 0.254: v37.19,47.95 36.58,47.35 36.58,46.74 U1.6
  Bottom 0.254: v37.19,47.95 39.83,45.31 45.11,45.31 47.75,47.95 74.57,47.95 76.2,46.33 IC6.12
RXHOLD  (via drill 0.61)
  Top 0.254: v36.78,44.09 36.17,44.7 36.17,45.72 35.97,45.92 35.97,46.53 U1.5
  Bottom 0.254: v36.78,44.09 37.19,43.69 46.53,43.69 47.75,42.47 55.68,42.47 57.3,40.84 59.94,40.84 61.37,42.27 62.18,42.27 63.4,43.48 77.01,43.48 78.64,45.11 78.64,45.72 IC6.13
RXSIGIN
  Top 0.254: U1.11 39.83,46.74 39.83,45.91 40.12,45.5 43.34,45.49 43.97,44.32 44.76,44.32 44.77,42.27 44.77,39.61 44.83,39.61 44.83,39.6 44.82,39.6 44.8,39.58 53.24,31.09 53.24,28.04 C14.1
  Bottom 0.254: 53.28,24.47 53.39,24.45 R16.2 | 53.28,24.47 53.31,24.56 53.41,24.6 R17.1 | 53.28,24.47 53.28,27.84 53.24,27.84 C14.1
RXSN
  Top 0.254: U1.23 33.93,52.63 33.93,53.03 33.12,53.85 33.12,59.54 R24.2
  Bottom 0.254: R14.1 15.44,58.32 17.07,56.69 29.87,56.69 32.72,59.54 32.92,59.54 R24.2
TRXPTT
  Bottom 0.254: X2.4 82.5,21.74 Q2.3
TX-232
  Top 0.254: IC6.17 76.2,53.44 75.18,54.46 75.18,54.86 71.12,58.93 SERIAL.3
TX/SN  (via drill 0.61)
  Top 0.254: IC6.2 51.82,44.7 51.82,44.09 52.83,43.08 52.83,39.83 51.61,38.61 46.53,38.61 v46.53,39.83 | v28.25,43.08 25.81,45.52 25.81,52.43 17.88,60.35 17.88,62.18 SW4.2
  Bottom 0.254: v46.53,39.83 43.28,43.08 v28.25,43.08
TXCLOCK  (via drill 0.61)
  Top 0.254: v35.36,53.85 34.54,53.03 34.54,52.63 U1.22 | v64.01,59.94 63.8,59.74 63.8,54.66 63.6,54.46 63.6,53.44 IC6.22
  Bottom 0.254: v35.36,53.85 38.41,56.9 43.28,56.9 46.33,59.94 v64.01,59.94
TXDATA
  Top 0.254: U1.19 36.58,52.63 36.37,52.83 36.37,60.15 34.14,62.38 34.14,62.59 33.12,63.6 27.03,63.6 27.03,62.59 SW3.1
  Bottom 0.254: SW4.1 20.32,62.38 26.62,62.38 SW3.1
TXDATA/MIC
  Top 0.254: X2.1 87.58,18.49 84.53,15.44 84.53,14.63 83.11,13.21 78.03,13.21 78.03,17.27 76.61,18.69 72.95,18.69 72.95,20.93 67.67,26.21 57.3,26.21 57.3,29.06 C3.2
TXOUT  (via drill 0.61)
  Top 0.254: v38.61,53.85 38.61,52.83 38.41,52.63 U1.16
  Bottom 0.254: v38.61,53.85 40.64,55.88 R6.1
USB+
  Bottom 0.254: IC6.16 84.02,46.02 90.07,46.02 90.02,45.97 90.02,48.16 J1.D+
USB-
  Bottom 0.254: IC6.15 81.28,53.24 86.36,48.16 88.19,48.16 J1.D-
VBIAS  (via drill 0.61)
  Top 0.254: C6.1 79.86,15.24 79.86,18.09 77.62,20.32 R15.2 77.42,20.32 71.53,26.21 70.1,26.21 70.1,28.85 68.68,30.28 68.68,32.92 R5.2 | v45.72,36.58 42.56,39.76 42.58,44.08 38.62,44.82 38.61,46.33 38.41,46.53 U1.9
  Bottom 0.254: v45.72,36.58 61.16,36.58 63.2,34.54 66.85,34.54 68.28,33.12 68.48,33.12 R5.2
VCC  (via drill 0.61)
  Top 0.254: IC1.15 24.18,20.32 24.18,17.88 IC1.16 23.98,17.68 22.96,16.66 22.96,14.02 C5.1 | R20.2 11.38,54.46 9.75,52.83 9.75,39.95 11.38,38.33 11.38,38.2 R28.1 11.58,38 11.58,33.12 R21.2 11.58,32.92 11.58,32.72 13.21,31.09 13.21,27.03 11.58,25.4 R22.2 11.38,25.4 11.38,25.2 9.75,23.57 9.75,16.87 11.38,15.24 R27.1 | IC5.8 58.93,32.51 58.93,38.81 58.52,39.22 R13.1 | R12.1 PICKIT2.2 | 38,51.61 37.8,51.82 37.8,52.43 U1.17 | 38,51.61 39.01,51.61 39.01,52.43 U1.15 | 34.95,46.74 35.15,46.74 U1.4 | 34.95,46.74 34.54,46.74 U1.3 | 32.92,51.21 32.92,49.58 34.95,47.55 34.95,46.74 | 32.92,51.21 32.92,52.22 33.12,52.43 U1.24 | v37.59,51.21 38,51.61 | v33.12,51.21 32.92,51.21 | 34.95,46.74 34.95,45.52 35.15,45.31 35.15,42.27 38,39.42 R25.1
  Bottom 0.254: R27.1 11.58,15.24 12.8,14.02 22.96,14.02 C5.1 | C11.1 11.38,62.18 11.38,54.66 R20.2 11.58,54.66 11.99,55.07 29.26,55.07 v33.12,51.21 v37.59,51.21 40.03,51.21 43.69,54.86 45.52,54.86 46.13,55.47 47.95,55.47 50.8,58.32 | C17.2 77.42,32.92 73.97,29.46 65.02,29.46 IC5.8 | 68.68,58.32 68.68,60.35 77.22,60.35 78.64,61.77 78.64,62.18 SW1.2 | 68.68,58.32 68.68,53.44 IC6.20 | 50.8,58.32 68.68,58.32 | 50.8,58.32 R12.1 | R13.1 58.32,39.22 57.3,38.2 41.66,38.2 41.25,37.8 39.83,37.8 38.41,39.22 38.2,39.22 R25.1
VPP
  Top 0.254: PICKIT2.1 48.36,62.18 48.36,58.52 R12.2 46.53,56.69 46.53,48.16 48.16,46.53 48.16,45.72 IC6.1 48.36,45.72 48.36,40.64 PROG.2

### Text on the board
Bottom: USB | RADIO
tPlace: PWR | http://www.gmskhotspot.com | PTT | LOW | NQSMHS V2 | NI2O 02/2011 | MED | HIGH | DCOS | COS | DCOS | Low | Medium | High | RX | TX
tNames: Serial #